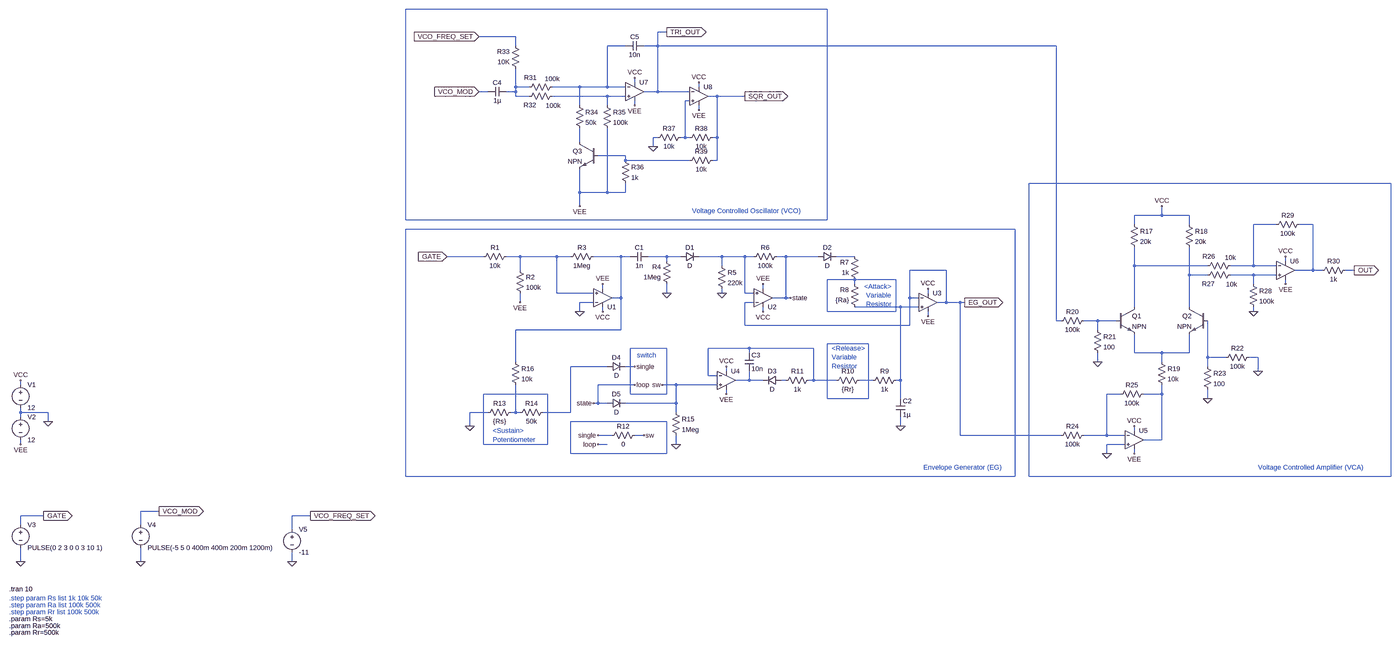
[diagram p0: schematic synth_top.asc, whole sheet]
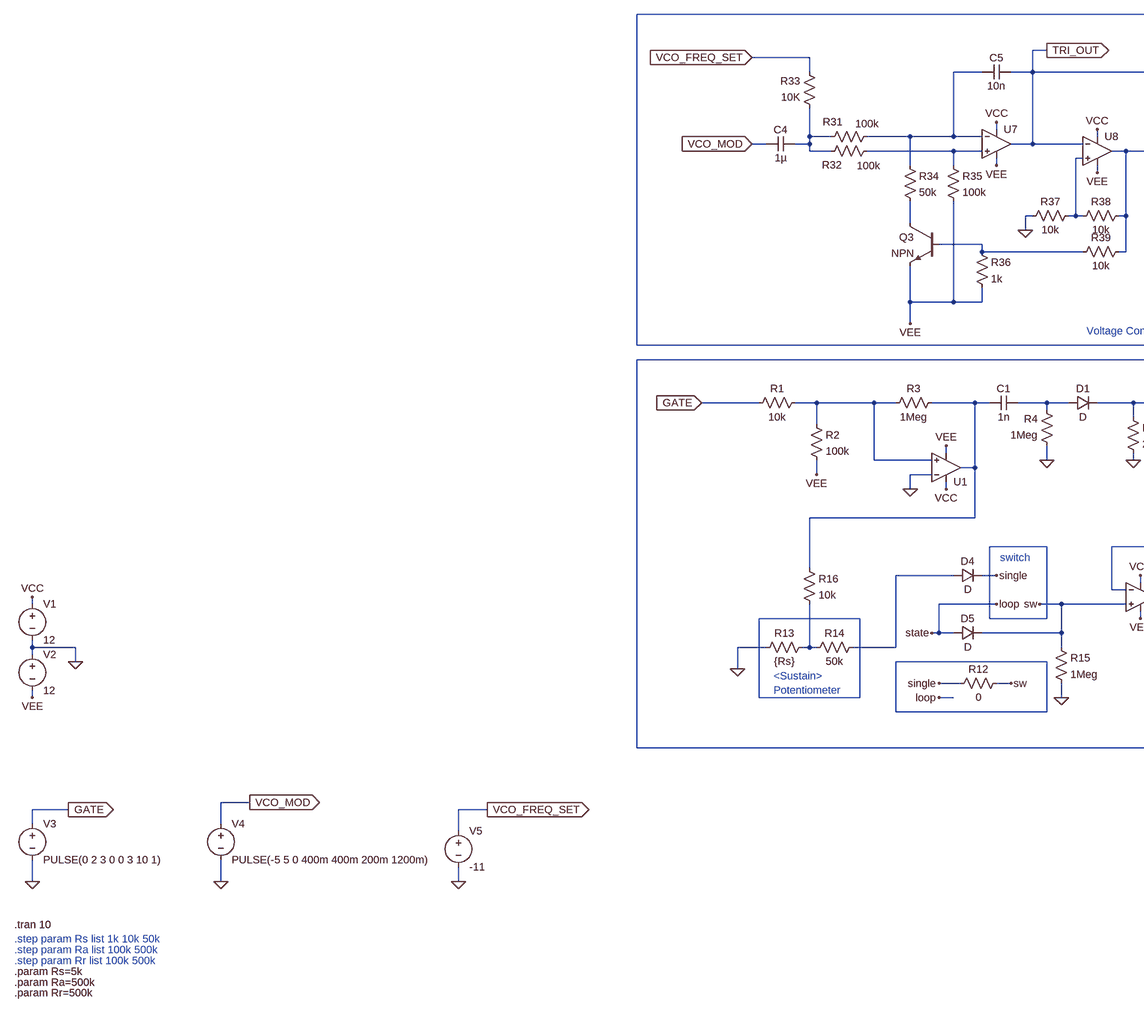
[diagram p1: schematic synth_top.asc, part, row 1 of 1, column 1 of 2]
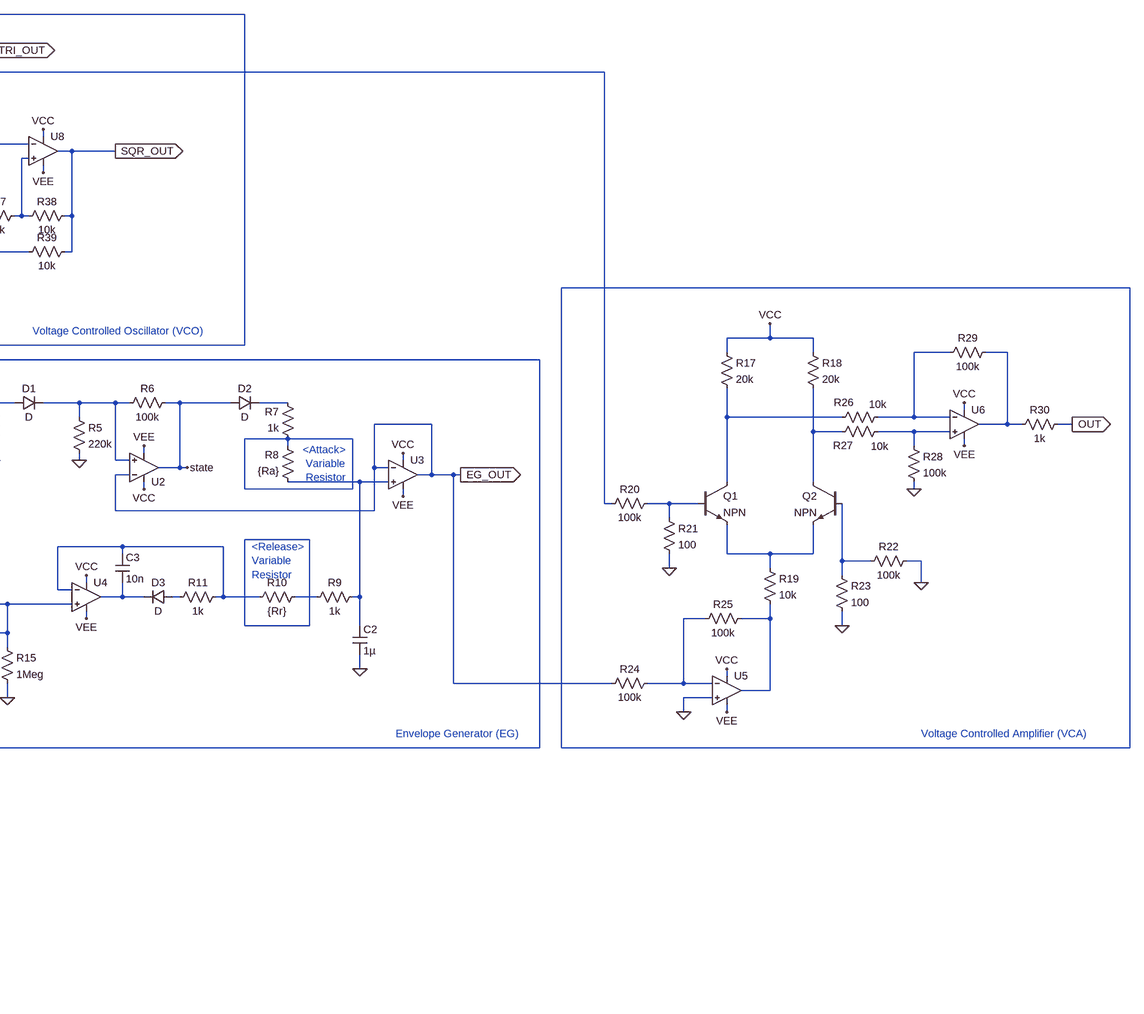
[diagram p2: schematic synth_top.asc, part, row 1 of 1, column 2 of 2]
synth_top.asc, the LTspice schematic file:
Version 4
SHEET 1 5316 1544
WIRE 2864 -1216 1392 -1216
WIRE 2304 -1136 2272 -1136
WIRE 1776 -1120 1648 -1120
WIRE 1776 -1088 1776 -1120
WIRE 2160 -1088 2096 -1088
WIRE 2272 -1088 2272 -1136
WIRE 2272 -1088 2224 -1088
WIRE 3664 -1088 2272 -1088
WIRE 2192 -960 2192 -976
WIRE 1776 -944 1776 -1008
WIRE 1824 -944 1776 -944
WIRE 2000 -944 1904 -944
WIRE 2096 -944 2096 -1088
WIRE 2096 -944 2000 -944
WIRE 2160 -944 2096 -944
WIRE 2416 -944 2416 -960
WIRE 1680 -928 1648 -928
WIRE 1776 -928 1776 -944
WIRE 1776 -928 1744 -928
WIRE 2272 -928 2272 -1088
WIRE 2272 -928 2224 -928
WIRE 2384 -928 2272 -928
WIRE 1776 -912 1776 -928
WIRE 1824 -912 1776 -912
WIRE 2096 -912 1904 -912
WIRE 2160 -912 2096 -912
WIRE 2480 -912 2448 -912
WIRE 2576 -912 2480 -912
WIRE 2384 -896 2368 -896
WIRE 2000 -880 2000 -944
WIRE 2096 -880 2096 -912
WIRE 2192 -880 2192 -896
WIRE 2416 -864 2416 -880
WIRE 2272 -768 2256 -768
WIRE 2368 -768 2368 -896
WIRE 2368 -768 2352 -768
WIRE 2384 -768 2368 -768
WIRE 2480 -768 2480 -912
WIRE 2480 -768 2464 -768
WIRE 2000 -752 2000 -800
WIRE 2256 -736 2256 -768
WIRE 2160 -704 2064 -704
WIRE 2160 -688 2160 -704
WIRE 2384 -688 2160 -688
WIRE 2480 -688 2480 -768
WIRE 2480 -688 2464 -688
WIRE 4832 -608 3568 -608
WIRE 2000 -576 2000 -656
WIRE 2096 -576 2096 -800
WIRE 2096 -576 2000 -576
WIRE 2160 -576 2160 -608
WIRE 2160 -576 2096 -576
WIRE 2000 -528 2000 -576
WIRE 4032 -496 4032 -528
WIRE 4032 -496 3936 -496
WIRE 4128 -496 4032 -496
WIRE 1392 -480 1392 -1216
WIRE 2864 -480 2864 -1216
WIRE 2864 -480 1392 -480
WIRE 3936 -464 3936 -496
WIRE 4128 -464 4128 -496
WIRE 4432 -464 4352 -464
WIRE 4560 -464 4512 -464
WIRE 3520 -448 1392 -448
WIRE 1664 -352 1536 -352
WIRE 1792 -352 1744 -352
WIRE 1920 -352 1792 -352
WIRE 1968 -352 1920 -352
WIRE 2144 -352 2048 -352
WIRE 2176 -352 2144 -352
WIRE 2304 -352 2240 -352
WIRE 2352 -352 2304 -352
WIRE 2496 -352 2416 -352
WIRE 2576 -352 2496 -352
WIRE 2608 -352 2576 -352
WIRE 2720 -352 2688 -352
WIRE 2832 -352 2720 -352
WIRE 2960 -352 2896 -352
WIRE 2304 -336 2304 -352
WIRE 4464 -336 4464 -352
WIRE 2496 -320 2496 -352
WIRE 3936 -320 3936 -384
WIRE 4192 -320 3936 -320
WIRE 4352 -320 4352 -464
WIRE 4352 -320 4272 -320
WIRE 4432 -320 4352 -320
WIRE 1792 -304 1792 -352
WIRE 3280 -304 3152 -304
WIRE 4560 -304 4560 -464
WIRE 4560 -304 4496 -304
WIRE 4592 -304 4560 -304
WIRE 4704 -304 4672 -304
WIRE 4128 -288 4128 -384
WIRE 4192 -288 4128 -288
WIRE 4352 -288 4272 -288
WIRE 4432 -288 4352 -288
WIRE 2960 -272 2864 -272
WIRE 3104 -272 2960 -272
WIRE 2960 -256 2960 -272
WIRE 4352 -256 4352 -288
WIRE 4464 -256 4464 -272
WIRE 2080 -240 2080 -256
WIRE 2640 -240 2640 -256
WIRE 1920 -224 1920 -352
WIRE 2048 -224 1920 -224
WIRE 2304 -224 2304 -256
WIRE 2496 -224 2496 -240
WIRE 2576 -224 2576 -352
WIRE 2608 -224 2576 -224
WIRE 3216 -224 3216 -240
WIRE 2144 -208 2144 -352
WIRE 2144 -208 2112 -208
WIRE 2720 -208 2720 -352
WIRE 2720 -208 2672 -208
WIRE 2736 -208 2720 -208
WIRE 3152 -208 3152 -304
WIRE 3184 -208 3152 -208
WIRE 1792 -192 1792 -224
WIRE 2048 -192 2000 -192
WIRE 2608 -192 2576 -192
WIRE 3280 -192 3280 -304
WIRE 3280 -192 3248 -192
WIRE 3328 -192 3280 -192
WIRE 3344 -192 3328 -192
WIRE 3120 -176 2960 -176
WIRE 3184 -176 3120 -176
WIRE 3936 -176 3936 -320
WIRE 4128 -176 4128 -288
WIRE 2000 -160 2000 -192
WIRE 2080 -160 2080 -176
WIRE 2640 -160 2640 -176
WIRE 2864 -160 2864 -272
WIRE 3104 -160 3104 -272
WIRE 3104 -160 2864 -160
WIRE 4352 -160 4352 -176
WIRE 3216 -144 3216 -160
WIRE 3664 -128 3664 -1088
WIRE 3680 -128 3664 -128
WIRE 3808 -128 3760 -128
WIRE 3872 -128 3808 -128
WIRE 2576 -112 2576 -192
WIRE 3152 -112 3152 -208
WIRE 3152 -112 2576 -112
WIRE 2144 -96 2144 -208
WIRE 2144 -96 1776 -96
WIRE 3808 -96 3808 -128
WIRE 3008 -48 2864 -48
WIRE 2304 -32 2176 -32
WIRE 2592 -32 2448 -32
WIRE 2816 -32 2592 -32
WIRE 2592 -16 2592 -32
WIRE 3936 -16 3936 -80
WIRE 4032 -16 3936 -16
WIRE 4128 -16 4128 -80
WIRE 4128 -16 4032 -16
WIRE 4192 0 4192 -128
WIRE 4256 0 4192 0
WIRE 4368 0 4336 0
WIRE 1776 16 1776 -96
WIRE 3808 16 3808 -16
WIRE 4032 16 4032 -16
WIRE 2096 32 1968 32
WIRE 2192 32 2160 32
WIRE 4192 32 4192 0
WIRE 2512 48 2512 32
WIRE 4368 48 4368 0
WIRE 2448 64 2448 -32
WIRE 2480 64 2448 64
WIRE 2592 80 2592 48
WIRE 2592 80 2544 80
WIRE 2640 80 2592 80
WIRE 2720 80 2704 80
WIRE 2816 80 2816 -32
WIRE 2816 80 2800 80
WIRE 2896 80 2816 80
WIRE 3024 80 2976 80
WIRE 3120 80 3120 -176
WIRE 3120 80 3104 80
WIRE -592 96 -592 80
WIRE 2192 96 2064 96
WIRE 2336 96 2288 96
WIRE 2480 96 2336 96
WIRE 1888 128 1664 128
WIRE 2176 128 2176 -32
WIRE 2304 128 2304 -32
WIRE 2304 128 2176 128
WIRE 2512 128 2512 112
WIRE 3888 128 3840 128
WIRE 4032 128 4032 96
WIRE 4032 128 3968 128
WIRE 2864 144 2864 -48
WIRE 3008 144 3008 -48
WIRE 3008 144 2864 144
WIRE 3120 144 3120 80
WIRE 4192 144 4192 112
WIRE 2064 160 2064 96
WIRE 2064 160 2048 160
WIRE 2096 160 2064 160
WIRE 2336 160 2336 96
WIRE 2336 160 2160 160
WIRE -592 192 -592 176
WIRE -496 192 -592 192
WIRE 1680 192 1616 192
WIRE 1776 192 1776 96
WIRE 1776 192 1760 192
WIRE 1792 192 1776 192
WIRE 1968 192 1968 32
WIRE 1968 192 1872 192
WIRE 2336 192 2336 160
WIRE -592 208 -592 192
WIRE -496 224 -496 192
WIRE 2304 224 1968 224
WIRE 1616 240 1616 192
WIRE 3120 240 3120 208
WIRE 3936 256 3936 240
WIRE 2112 272 2064 272
WIRE 2224 272 2192 272
WIRE 3328 272 3328 -192
WIRE 3680 272 3328 272
WIRE 3840 272 3840 128
WIRE 3840 272 3760 272
WIRE 3904 272 3840 272
WIRE 4032 288 4032 128
WIRE 4032 288 3968 288
WIRE -592 304 -592 288
WIRE 1664 304 1664 128
WIRE 1888 304 1888 128
WIRE 1888 304 1664 304
WIRE 2096 304 2064 304
WIRE 2336 304 2336 272
WIRE 3904 304 3840 304
WIRE 1968 336 1968 224
WIRE 2304 336 2304 224
WIRE 2304 336 1968 336
WIRE 3840 336 3840 304
WIRE 3936 336 3936 320
WIRE 1392 416 1392 -448
WIRE 3520 416 3520 -448
WIRE 3520 416 1392 416
WIRE 3568 416 3568 -608
WIRE 4832 416 4832 -608
WIRE 4832 416 3568 416
WIRE -32 672 -96 672
WIRE -512 688 -592 688
WIRE 496 688 432 688
WIRE -592 720 -592 688
WIRE -96 720 -96 672
WIRE 432 736 432 688
WIRE -592 848 -592 800
WIRE -96 848 -96 800
WIRE 432 848 432 816
FLAG -592 80 VCC
FLAG -592 304 VEE
FLAG -496 224 0
FLAG 2080 -160 VCC
FLAG 2080 -256 VEE
FLAG 2000 -160 0
FLAG 1792 -192 VEE
FLAG 1536 -352 GATE
IOPIN 1536 -352 In
FLAG 2304 -224 0
FLAG 2640 -160 VCC
FLAG 2640 -256 VEE
FLAG 2496 -224 0
FLAG 3216 -240 VCC
FLAG 3216 -144 VEE
FLAG 3344 -192 EG_OUT
IOPIN 3344 -192 Out
FLAG 3120 240 0
FLAG 2512 32 VCC
FLAG 2512 128 VEE
FLAG 2736 -208 state
FLAG 2048 160 state
FLAG 2192 96 loop
FLAG 2192 32 single
FLAG 2288 96 sw
FLAG 2064 272 single
FLAG 2064 304 loop
FLAG 2224 272 sw
FLAG 1616 240 0
FLAG -512 688 GATE
IOPIN -512 688 Out
FLAG -592 848 0
FLAG 2336 304 0
FLAG 4032 -528 VCC
FLAG 3808 16 0
FLAG 4192 144 0
FLAG 4368 48 0
FLAG 3936 240 VCC
FLAG 3936 336 VEE
FLAG 3840 336 0
FLAG 4464 -352 VCC
FLAG 4464 -256 VEE
FLAG 4352 -160 0
FLAG 2192 -976 VCC
FLAG 2192 -880 VEE
FLAG 1648 -928 VCO_MOD
IOPIN 1648 -928 In
FLAG 1648 -1120 VCO_FREQ_SET
IOPIN 1648 -1120 In
FLAG 2000 -528 VEE
FLAG 2416 -960 VCC
FLAG 2416 -864 VEE
FLAG 2256 -736 0
FLAG -32 672 VCO_MOD
IOPIN -32 672 Out
FLAG -96 848 0
FLAG 496 688 VCO_FREQ_SET
IOPIN 496 688 Out
FLAG 432 848 0
FLAG 4704 -304 OUT
IOPIN 4704 -304 Out
FLAG 2576 -912 SQR_OUT
IOPIN 2576 -912 Out
FLAG 2304 -1136 TRI_OUT
IOPIN 2304 -1136 Out
SYMBOL OpAmps\\UniversalOpAmp2 2080 -208 M180
SYMATTR InstName U1
SYMBOL voltage -592 80 R0
SYMATTR InstName V1
SYMATTR Value 12
SYMBOL voltage -592 192 R0
SYMATTR InstName V2
SYMATTR Value 12
SYMBOL res 1760 -368 R90
WINDOW 0 0 56 VBottom 2
WINDOW 3 32 56 VTop 2
SYMATTR InstName R1
SYMATTR Value 10k
SYMBOL res 1776 -320 R0
SYMATTR InstName R2
SYMATTR Value 100k
SYMBOL res 2064 -368 R90
WINDOW 0 0 56 VBottom 2
WINDOW 3 32 56 VTop 2
SYMATTR InstName R3
SYMATTR Value 1Meg
SYMBOL cap 2240 -368 R90
WINDOW 0 0 32 VBottom 2
WINDOW 3 32 32 VTop 2
SYMATTR InstName C1
SYMATTR Value 1n
SYMBOL res 2320 -240 R180
WINDOW 0 36 76 Left 2
WINDOW 3 36 40 Left 2
SYMATTR InstName R4
SYMATTR Value 1Meg
SYMBOL OpAmps\\UniversalOpAmp2 2640 -208 M180
SYMATTR InstName U2
SYMBOL res 2480 -336 R0
SYMATTR InstName R5
SYMATTR Value 220k
SYMBOL res 2704 -368 R90
WINDOW 0 0 56 VBottom 2
WINDOW 3 32 56 VTop 2
SYMATTR InstName R6
SYMATTR Value 100k
SYMBOL res 2976 -256 R180
WINDOW 0 36 76 Left 2
WINDOW 3 36 40 Left 2
SYMATTR InstName R7
SYMATTR Value 1k
SYMBOL res 2976 -160 R180
WINDOW 0 36 76 Left 2
WINDOW 3 36 40 Left 2
SYMATTR InstName R8
SYMATTR Value {Ra}
SYMBOL OpAmps\\UniversalOpAmp2 3216 -192 R0
SYMATTR InstName U3
SYMBOL cap 3104 144 R0
SYMATTR InstName C2
SYMATTR Value 1µ
SYMBOL res 3120 64 R90
WINDOW 0 0 56 VBottom 2
WINDOW 3 32 56 VTop 2
SYMATTR InstName R9
SYMATTR Value 1k
SYMBOL res 2880 96 R270
WINDOW 0 32 56 VTop 2
WINDOW 3 0 56 VBottom 2
SYMATTR InstName R10
SYMATTR Value {Rr}
SYMBOL res 2816 64 R90
WINDOW 0 0 56 VBottom 2
WINDOW 3 32 56 VTop 2
SYMATTR InstName R11
SYMATTR Value 1k
SYMBOL cap 2576 -16 R0
SYMATTR InstName C3
SYMATTR Value 10n
SYMBOL OpAmps\\UniversalOpAmp2 2512 80 R0
SYMATTR InstName U4
SYMBOL res 2208 256 R90
WINDOW 0 0 56 VBottom 2
WINDOW 3 32 56 VTop 2
SYMATTR InstName R12
SYMATTR Value 0
SYMBOL res 1776 176 R90
WINDOW 0 0 56 VBottom 2
WINDOW 3 32 56 VTop 2
SYMATTR InstName R13
SYMATTR Value {Rs}
SYMBOL res 1888 176 R90
WINDOW 0 0 56 VBottom 2
WINDOW 3 32 56 VTop 2
SYMATTR InstName R14
SYMATTR Value 50k
SYMBOL voltage -592 704 R0
WINDOW 123 0 0 Left 0
WINDOW 39 0 0 Left 0
SYMATTR InstName V3
SYMATTR Value PULSE(0 2 3 0 0 3 10 1)
SYMBOL res 2320 176 R0
SYMATTR InstName R15
SYMATTR Value 1Meg
SYMBOL res 1760 0 R0
SYMATTR InstName R16
SYMATTR Value 10k
SYMBOL res 3920 -480 R0
SYMATTR InstName R17
SYMATTR Value 20k
SYMBOL res 4112 -480 R0
SYMATTR InstName R18
SYMATTR Value 20k
SYMBOL res 4016 0 R0
SYMATTR InstName R19
SYMATTR Value 10k
SYMBOL res 3776 -144 R90
WINDOW 0 0 56 VBottom 2
WINDOW 3 32 56 VTop 2
SYMATTR InstName R20
SYMATTR Value 100k
SYMBOL res 3792 -112 R0
SYMATTR InstName R21
SYMATTR Value 100
SYMBOL res 4352 -16 R90
WINDOW 0 0 56 VBottom 2
WINDOW 3 32 56 VTop 2
SYMATTR InstName R22
SYMATTR Value 100k
SYMBOL res 4176 16 R0
SYMATTR InstName R23
SYMATTR Value 100
SYMBOL OpAmps\\UniversalOpAmp2 3936 288 R0
SYMATTR InstName U5
SYMBOL res 3776 256 R90
WINDOW 0 0 56 VBottom 2
WINDOW 3 32 56 VTop 2
SYMATTR InstName R24
SYMATTR Value 100k
SYMBOL res 3984 112 R90
WINDOW 0 0 56 VBottom 2
WINDOW 3 32 56 VTop 2
SYMATTR InstName R25
SYMATTR Value 100k
SYMBOL OpAmps\\UniversalOpAmp2 4464 -304 R0
SYMATTR InstName U6
SYMBOL res 4288 -336 R90
WINDOW 0 -1 92 VBottom 2
WINDOW 3 -28 16 VTop 2
SYMATTR InstName R26
SYMATTR Value 10k
SYMBOL res 4288 -304 R90
WINDOW 0 63 94 VBottom 2
WINDOW 3 33 12 VTop 2
SYMATTR InstName R27
SYMATTR Value 10k
SYMBOL res 4336 -272 R0
SYMATTR InstName R28
SYMATTR Value 100k
SYMBOL res 4528 -480 R90
WINDOW 0 0 56 VBottom 2
WINDOW 3 32 56 VTop 2
SYMATTR InstName R29
SYMATTR Value 100k
SYMBOL res 4688 -320 R90
WINDOW 0 0 56 VBottom 2
WINDOW 3 32 56 VTop 2
SYMATTR InstName R30
SYMATTR Value 1k
SYMBOL OpAmps\\UniversalOpAmp2 2192 -928 R0
SYMATTR InstName U7
SYMBOL res 1920 -960 R90
WINDOW 0 -1 92 VBottom 2
WINDOW 3 -28 16 VTop 2
SYMATTR InstName R31
SYMATTR Value 100k
SYMBOL res 1920 -928 R90
WINDOW 0 63 94 VBottom 2
WINDOW 3 33 12 VTop 2
SYMATTR InstName R32
SYMATTR Value 100k
SYMBOL cap 1744 -944 R90
WINDOW 0 0 32 VBottom 2
WINDOW 3 32 32 VTop 2
SYMATTR InstName C4
SYMATTR Value 1µ
SYMBOL res 1792 -992 R180
WINDOW 0 36 76 Left 2
WINDOW 3 36 40 Left 2
SYMATTR InstName R33
SYMATTR Value 10K
SYMBOL res 1984 -896 R0
SYMATTR InstName R34
SYMATTR Value 50k
SYMBOL res 2080 -896 R0
SYMATTR InstName R35
SYMATTR Value 100k
SYMBOL res 2144 -704 R0
SYMATTR InstName R36
SYMATTR Value 1k
SYMBOL cap 2224 -1104 R90
WINDOW 0 0 32 VBottom 2
WINDOW 3 32 32 VTop 2
SYMATTR InstName C5
SYMATTR Value 10n
SYMBOL OpAmps\\UniversalOpAmp2 2416 -912 R0
SYMATTR InstName U8
SYMBOL res 2368 -784 R90
WINDOW 0 0 56 VBottom 2
WINDOW 3 32 56 VTop 2
SYMATTR InstName R37
SYMATTR Value 10k
SYMBOL res 2480 -784 R90
WINDOW 0 0 56 VBottom 2
WINDOW 3 32 56 VTop 2
SYMATTR InstName R38
SYMATTR Value 10k
SYMBOL res 2480 -704 R90
WINDOW 0 0 56 VBottom 2
WINDOW 3 32 56 VTop 2
SYMATTR InstName R39
SYMATTR Value 10k
SYMBOL voltage -96 704 R0
WINDOW 123 0 0 Left 0
WINDOW 39 0 0 Left 0
SYMATTR InstName V4
SYMATTR Value PULSE(-5 5 0 400m 400m 200m 1200m)
SYMBOL voltage 432 720 R0
WINDOW 123 0 0 Left 0
WINDOW 39 0 0 Left 0
SYMATTR InstName V5
SYMATTR Value -11
SYMBOL diode 2352 -336 R270
WINDOW 0 32 32 VTop 2
WINDOW 3 0 32 VBottom 2
SYMATTR InstName D1
SYMBOL diode 2832 -336 R270
WINDOW 0 32 32 VTop 2
WINDOW 3 0 32 VBottom 2
SYMATTR InstName D2
SYMBOL diode 2704 64 R90
WINDOW 0 0 32 VBottom 2
WINDOW 3 32 32 VTop 2
SYMATTR InstName D3
SYMBOL diode 2096 48 R270
WINDOW 0 32 32 VTop 2
WINDOW 3 0 32 VBottom 2
SYMATTR InstName D4
SYMBOL diode 2096 176 R270
WINDOW 0 32 32 VTop 2
WINDOW 3 0 32 VBottom 2
SYMATTR InstName D5
SYMBOL npn 3872 -176 R0
SYMATTR InstName Q1
SYMBOL npn 4192 -176 M0
SYMATTR InstName Q2
SYMBOL npn 2064 -752 M0
SYMATTR InstName Q3
TEXT 3088 -248 Right 2 ;<Attack>\nVariable\nResistor
TEXT 2880 -32 Left 2 ;<Release>\nVariable\nResistor
TEXT 2200 -8 Left 2 ;switch
TEXT -632 944 Left 2 !.tran 10
TEXT 1696 256 Left 2 ;<Sustain>\nPotentiometer
TEXT -632 976 Left 2 ;.step param Rs list 1k 10k 50k
TEXT -632 1000 Left 2 ;.step param Ra list 100k 500k
TEXT -632 1024 Left 2 ;.step param Rr list 100k 500k
TEXT 3200 384 Left 2 ;Envelope Generator (EG)
TEXT 4368 384 Left 2 ;Voltage Controlled Amplifier (VCA)
TEXT -632 1048 Left 2 !.param Rs=5k
TEXT -632 1072 Left 2 !.param Ra=500k
TEXT -632 1096 Left 2 !.param Rr=500k
TEXT 2392 -512 Left 2 ;Voltage Controlled Oscillator (VCO)

The netlist it stands for:
* synth_top.asc
XU1 N012 0 VCC VEE N013 level2 Avol=1Meg GBW=10Meg Slew=10Meg Ilimit=25m Rail=0 Vos=0 En=0 Enk=0 In=0 Ink=0 Rin=500Meg  ; pins In+ In- V+ V- OUT
V1 VCC 0 12
V2 0 VEE 12
R1 N012 GATE 10k
R2 N012 VEE 100k
R3 N013 N012 1Meg
C1 N014 N013 1n
R4 0 N014 1Meg
XU2 N015 EG_OUT VCC VEE loop level2 Avol=1Meg GBW=10Meg Slew=10Meg Ilimit=25m Rail=0 Vos=0 En=0 Enk=0 In=0 Ink=0 Rin=500Meg  ; pins In+ In- V+ V- OUT
R5 N015 0 220k
R6 loop N015 100k
R7 N020 N016 1k
R8 N021 N020 {Ra}
XU3 N021 EG_OUT VCC VEE EG_OUT level2 Avol=1Meg GBW=10Meg Slew=10Meg Ilimit=25m Rail=0 Vos=0 En=0 Enk=0 In=0 Ink=0 Rin=500Meg  ; pins In+ In- V+ V- OUT
C2 N021 0 1µ
R9 N021 N031 1k
R10 N025 N031 {Rr}
R11 N025 N030 1k
C3 N025 N029 10n
XU4 sw N025 VCC VEE N029 level2 Avol=1Meg GBW=10Meg Slew=10Meg Ilimit=25m Rail=0 Vos=0 En=0 Enk=0 In=0 Ink=0 Rin=500Meg  ; pins In+ In- V+ V- OUT
R12 sw single 0
R13 N035 0 {Rs}
R14 N028 N035 50k
V3 GATE 0 PULSE(0 2 3 0 0 3 10 1)
R15 sw 0 1Meg
R16 N013 N035 10k
R17 VCC N017 20k
R18 VCC N018 20k
R19 N026 N034 10k
R20 N022 TRI_OUT 100k
R21 N022 0 100
R22 0 N027 100k
R23 N027 0 100
XU5 0 N033 VCC VEE N034 level2 Avol=1Meg GBW=10Meg Slew=10Meg Ilimit=25m Rail=0 Vos=0 En=0 Enk=0 In=0 Ink=0 Rin=500Meg  ; pins In+ In- V+ V- OUT
R24 N033 EG_OUT 100k
R25 N034 N033 100k
XU6 N019 N009 VCC VEE N010 level2 Avol=1Meg GBW=10Meg Slew=10Meg Ilimit=25m Rail=0 Vos=0 En=0 Enk=0 In=0 Ink=0 Rin=500Meg  ; pins In+ In- V+ V- OUT
R26 N009 N017 10k
R27 N019 N018 10k
R28 N019 0 100k
R29 N010 N009 100k
R30 OUT N010 1k
XU7 N004 N002 VCC VEE TRI_OUT level2 Avol=1Meg GBW=10Meg Slew=10Meg Ilimit=25m Rail=0 Vos=0 En=0 Enk=0 In=0 Ink=0 Rin=500Meg  ; pins In+ In- V+ V- OUT
R31 N002 N003 100k
R32 N004 N003 100k
C4 N003 VCO_MOD 1µ
R33 N003 VCO_FREQ_SET 10K
R34 N002 N006 50k
R35 N004 VEE 100k
R36 N007 VEE 1k
C5 TRI_OUT N002 10n
XU8 N005 TRI_OUT VCC VEE SQR_OUT level2 Avol=1Meg GBW=10Meg Slew=10Meg Ilimit=25m Rail=0 Vos=0 En=0 Enk=0 In=0 Ink=0 Rin=500Meg  ; pins In+ In- V+ V- OUT
R37 N005 0 10k
R38 SQR_OUT N005 10k
R39 SQR_OUT N007 10k
V4 VCO_MOD 0 PULSE(-5 5 0 400m 400m 200m 1200m)
V5 VCO_FREQ_SET 0 -11
D1 N014 N015 D
D2 loop N016 D
D3 N030 N029 D
D4 N028 single D
D5 loop sw D
Q1 N017 N022 N026 0 NPN
Q2 N018 N027 N026 0 NPN
Q3 N006 N007 VEE 0 NPN
.model D D
.lib standard.dio
.model NPN NPN
.model PNP PNP
.lib standard.bjt
* <Attack>
* Variable
* Resistor
* <Release>
* Variable
* Resistor
* switch
.tran 10
* <Sustain>
* Potentiometer
* .step param Rs list 1k 10k 50k
* .step param Ra list 100k 500k
* .step param Rr list 100k 500k
* Envelope Generator (EG)
* Voltage Controlled Amplifier (VCA)
.param Rs=5k
.param Ra=500k
.param Rr=500k
* Voltage Controlled Oscillator (VCO)
.lib UniversalOpAmp2.lib
.backanno
.end